# Altium schematic sheet Sheet1.SchDoc
size A4; Organization: Altium Limited; Address1: L3, 12a Rodborough Rd; Address2: Frenchs Forest; Address3: NSW; Address4: Australia 2086
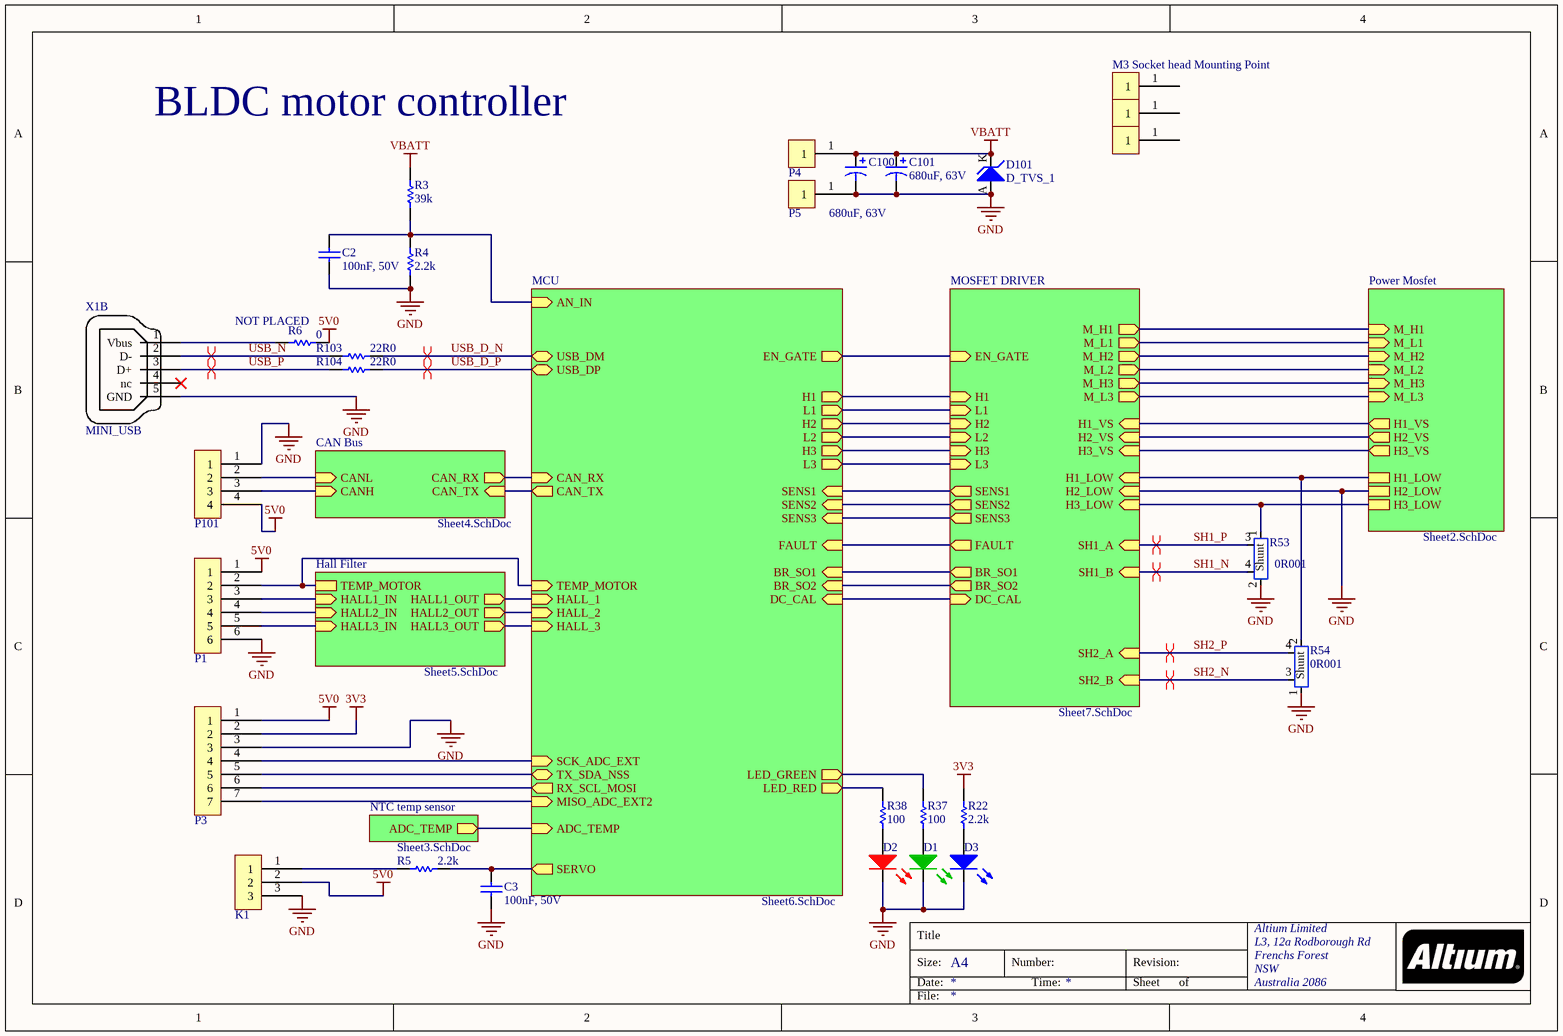
[diagram p0: Sheet1.SchDoc]

## Parts
C2  value 100nF, 50V  [SMD-0603 Capacitor]  (hidden comment: Voltage important)
C3  value 100nF, 50V  [SMD-0603 Capacitor]  (hidden comment: Voltage important)
C100  value 680uF, 63V  [ALU CAP 16DIA 25HIGH]  (hidden comment: CAP_POL)
C101  value 680uF, 63V  [ALU CAP 16DIA 25HIGH]  (hidden comment: CAP_POL)
D1  LED_GREEN  [SMD-0603 LED GREEN]  (value not drawn)
D2  LED_RED  [SMD-0603 LED RED]  (value not drawn)
D3  LED_BLUE  [SMD-0603 LED BLUE]  (value not drawn)
D101  D_TVS_1  [SMC-403-03]
K1  -  [HEADER 3 PIN]  (value not drawn)
M1  M3 Socket head Mounting Point  [M3 Socket head]
M2  M3 Socket head Mounting Point  [M3 Socket head]  (value not drawn)
M3  M3 Socket head Mounting Point  [M3 Socket head]  (value not drawn)
P1  B6B-PH-K-S(LF)(SN)  [JST PH TH VERT 6]  (value not drawn)
P3  B7B-PH-K-S(LF)(SN)  [JST PH TH VERT 7]  (value not drawn)
P4  -  [PAD1]  (value not drawn)
P5  -  [PAD1]  (value not drawn)
P101  B4B-PH-K-S(LF)(SN)  [JST PH TH VERT 4]  (value not drawn)
R3  39k  [SMD-0603 Resistor]
R4  2.2k  [SMD-0603 Resistor]
R5  2.2k  [SMD-0603 Resistor]
R6  0  Place (YES/NO): NOT PLACED  [SMD-0603 Resistor]
R22  2.2k  [SMD-0603 Resistor]
R37  100  [SMD-0603 Resistor]
R38  100  [SMD-0603 Resistor]
R53  0R001  [WSLP2726]
R54  0R001  [WSLP2726]
R103  22R0  [SMD-0603 Resistor]
R104  22R0  [SMD-0603 Resistor]
X1B  MINI_USB  [USB-MICRO B RA SMT-TH]

## Sub-sheets
CAN Bus = Sheet4.SchDoc: CANH (in), CANL (in), CAN_RX (out), CAN_TX (in)
Hall Filter = Sheet5.SchDoc: HALL3_IN (in), HALL2_IN (in), HALL1_IN (in), HALL3_OUT (out), HALL2_OUT (out), HALL1_OUT (out), TEMP_MOTOR
MCU = Sheet6.SchDoc: SENS3 (in), SENS2 (in), SENS1 (in), ADC_TEMP (in), SCK_ADC_EXT (in), MISO_ADC_EXT2 (in), H3 (out), H2 (out), H1 (out), USB_DM (bidir), USB_DP (bidir), BR_SO1 (in), BR_SO2 (in), SERVO (out), HALL_1 (in), HALL_2 (in), CAN_RX (in), CAN_TX (out), DC_CAL (in), L1 (out), L2 (out), L3 (out), TEMP_MOTOR (in), AN_IN (in), LED_GREEN (out), LED_RED (out), TX_SDA_NSS (bidir), RX_SCL_MOSI (out), EN_GATE (out), HALL_3 (in), FAULT (in)
MOSFET DRIVER = Sheet7.SchDoc: FAULT (out), DC_CAL (in), EN_GATE (in), H1 (in), L1 (in), H2 (in), L2 (in), H3 (in), L3 (in), BR_SO1 (out), BR_SO2 (out), M_H1 (out), M_L1 (out), H1_LOW (in), M_H2 (out), H2_VS (in), M_L2 (out), H2_LOW (in), M_H3 (out), H3_VS (in), M_L3 (out), H3_LOW (in), SH1_A (in), SH1_B (in), SH2_A (in), SH2_B (in), SENS1 (out), SENS2 (out), H1_VS (in), SENS3 (out)
NTC temp sensor = Sheet3.SchDoc: ADC_TEMP (out)
Power Mosfet = Sheet2.SchDoc: H1_VS (out), M_H1 (in), M_L1 (in), H1_LOW, H2_VS (out), M_H2 (in), M_L2 (in), H2_LOW, H3_VS (out), M_H3 (in), M_L3 (in), H3_LOW

## Nets
3V3: P3.2 R22.2
5V0: K1.2 P1.1 P3.1 P101.4 R6.2
GND: C2.2 C3.1 C100.2 C101.2 D1.2 D2.2 D3.2 D101.A K1.3 P1.6 P3.3 P5.1 P101.1 R4.1 R53.2 R54.1 X1B.5(GND) ; sheet MOSFET DRIVER/H2_LOW, sheet Power Mosfet/H2_LOW
VBATT: C100.1 C101.1 D101.K P4.1 R3.2
SH1_N: R53.4 ; sheet MOSFET DRIVER/SH1_B
SH1_P: R53.3 ; sheet MOSFET DRIVER/SH1_A
SH2_N: R54.3 ; sheet MOSFET DRIVER/SH2_B
SH2_P: R54.4 ; sheet MOSFET DRIVER/SH2_A
USB_D_N: R103.2 ; sheet MCU/USB_DM
USB_D_P: R104.2 ; sheet MCU/USB_DP
USB_N: R103.1 X1B.2(D-)
USB_P: R104.1 X1B.3(D+)
NetC2_1: C2.1 R3.1 R4.2 ; sheet MCU/AN_IN
NetC3_2: C3.2 R5.2 ; sheet MCU/SERVO
NetD1_1: D1.1 R37.1
NetD2_1: D2.1 R38.1
NetD3_1: D3.1 R22.1
NetK1_1: K1.1 R5.1
NetP1_2: P1.2 ; sheet MCU/TEMP_MOTOR, sheet Hall Filter/TEMP_MOTOR
NetP1_3: P1.3 ; sheet Hall Filter/HALL1_IN
NetP1_4: P1.4 ; sheet Hall Filter/HALL2_IN
NetP1_5: P1.5 ; sheet Hall Filter/HALL3_IN
NetP3_4: P3.4 ; sheet MCU/SCK_ADC_EXT
NetP3_5: P3.5 ; sheet MCU/TX_SDA_NSS
NetP3_6: P3.6 ; sheet MCU/RX_SCL_MOSI
NetP3_7: P3.7 ; sheet MCU/MISO_ADC_EXT2
NetP101_2: P101.2 ; sheet CAN Bus/CANL
NetP101_3: P101.3 ; sheet CAN Bus/CANH
NetR6_1: R6.1 X1B.1(Vbus)
NetR37_2: R37.2 ; sheet MCU/LED_GREEN
NetR38_2: R38.2 ; sheet MCU/LED_RED
NetR53_1: R53.1 ; sheet MOSFET DRIVER/H3_LOW, sheet Power Mosfet/H3_LOW
NetR54_2: R54.2 ; sheet MOSFET DRIVER/H1_LOW, sheet Power Mosfet/H1_LOW
(unnamed): sheet MOSFET DRIVER/FAULT, sheet MCU/FAULT
(unnamed): sheet MOSFET DRIVER/DC_CAL, sheet MCU/DC_CAL
(unnamed): sheet MOSFET DRIVER/EN_GATE, sheet MCU/EN_GATE
(unnamed): sheet MOSFET DRIVER/H1, sheet MCU/H1
(unnamed): sheet MOSFET DRIVER/L1, sheet MCU/L1
(unnamed): sheet MOSFET DRIVER/H2, sheet MCU/H2
(unnamed): sheet MOSFET DRIVER/L2, sheet MCU/L2
(unnamed): sheet MOSFET DRIVER/H3, sheet MCU/H3
(unnamed): sheet MOSFET DRIVER/L3, sheet MCU/L3
(unnamed): sheet MOSFET DRIVER/BR_SO1, sheet MCU/BR_SO1
(unnamed): sheet MOSFET DRIVER/BR_SO2, sheet MCU/BR_SO2
(unnamed): sheet MOSFET DRIVER/M_H1, sheet Power Mosfet/M_H1
(unnamed): sheet MOSFET DRIVER/M_L1, sheet Power Mosfet/M_L1
(unnamed): sheet MOSFET DRIVER/M_H2, sheet Power Mosfet/M_H2
(unnamed): sheet MOSFET DRIVER/H2_VS, sheet Power Mosfet/H2_VS
(unnamed): sheet MOSFET DRIVER/M_L2, sheet Power Mosfet/M_L2
(unnamed): sheet MOSFET DRIVER/M_H3, sheet Power Mosfet/M_H3
(unnamed): sheet MOSFET DRIVER/H3_VS, sheet Power Mosfet/H3_VS
(unnamed): sheet MOSFET DRIVER/M_L3, sheet Power Mosfet/M_L3
(unnamed): sheet MOSFET DRIVER/SENS1, sheet MCU/SENS1
(unnamed): sheet MOSFET DRIVER/SENS2, sheet MCU/SENS2
(unnamed): sheet MOSFET DRIVER/H1_VS, sheet Power Mosfet/H1_VS
(unnamed): sheet MOSFET DRIVER/SENS3, sheet MCU/SENS3
(unnamed): sheet MCU/ADC_TEMP, sheet NTC temp sensor/ADC_TEMP
(unnamed): sheet MCU/HALL_1, sheet Hall Filter/HALL1_OUT
(unnamed): sheet MCU/HALL_2, sheet Hall Filter/HALL2_OUT
(unnamed): sheet MCU/CAN_RX, sheet CAN Bus/CAN_RX
(unnamed): sheet MCU/CAN_TX, sheet CAN Bus/CAN_TX
(unnamed): sheet MCU/HALL_3, sheet Hall Filter/HALL3_OUT

Not connected (* = marked no-connect by the designer): M1 1; M2 1; M3 1; X1B 4(nc)*

## Layout directives
differential pair: SH1_N, SH1_P, SH2_N, SH2_P, USB_D_N, USB_D_P, USB_N, USB_P

## Notes on the sheet
- BLDC motor controller
- Title
- Size:
- Date:
- A4
- Number:
- Time:
- Revision:
- Sheet
- of
- File:
- (in symbol 13) Shunt
- (in symbol 14) Shunt

## Library data of the parts
C2 C3 = 7: CAP 100n, 50V, 0603; Manufacturer Part Number: 06035C104JAT2A; Manufacturer: AVX Corporation; ID: 7; Place (YES/NO): YES
C100 C101 = 21: 680µF 63V Aluminum Capacitors Radial; Manufacturer Part Number: UPW1J681MHD; Manufacturer: Nichicon; ID: 21; Place (YES/NO): YES
D1 = 1: LED Green, 0603; Part Number: LTST-C191KGKT; Manufacturer: Lite-On Inc.; ID: 1; Place (YES/NO): YES; Manufacturer Part Number: LTST-C191KGKT
D2 = 2: LED Red, 0603; Part Number: LTST-C191KRKT; Manufacturer: Lite-On Inc.; ID: 2; Place (YES/NO): YES; Manufacturer Part Number: LTST-C191KRKT
D3 = 3: LED Blue, 0603; Part Number: LBQ39GN1P1351; Manufacturer: OSRAM; ID: 3; Place (YES/NO): YES; Manufacturer Part Number: LBQ39GN1P1351
D101 = 16: TVS DIODE 51VWM 82.4VC SMC; Manufacturer Part Number: SMCJ51A; Manufacturer: ON Semiconductor; ID: 16; Value: 51V; Place (YES/NO): YES
K1 = 6: Breakaway 3 pin Through hole; ID: 6; Place (YES/NO): YES; Manufacturer Part Number: -; Manufacturer: -
M1-M3 = 1: ID: 1; Place (YES/NO): yes; Value: M3
P1 = 3: JST PH Through hole Vertical 6 Pin; ID: 3; Value: JST PH 6 PIN; Place (YES/NO): YES; Manufacturer Part Number: B6B-PH-K-S(LF)(SN); Manufacturer: JST
P3 = 4: JST PH Through hole Vertical 7 Pin; ID: 4; Value: JST PH 4 PIN; Place (YES/NO): YES; Manufacturer Part Number: B7B-PH-K-S(LF)(SN); Manufacturer: JST
P4 P5 = 1: SMD Power landing; ID: 1; Value: -; Place (YES/NO): -; Manufacturer Part Number: -; Manufacturer: -
P101 = 2: JST PH Through hole Vertical 4 Pin; ID: 2; Value: JST PH 4 PIN; Place (YES/NO): YES; Manufacturer Part Number: B4B-PH-K-S(LF)(SN); Manufacturer: JST
R3 = 8: R 39k, 0603; Manufacturer Part Number: ERJ-3EKF3902V; Manufacturer: Panasonic Electronic Components; ID: 8; Place (YES/NO): YES; Value: 39k
R4 R5 R22 = 3: R 2.2k, 0603; Manufacturer Part Number: RK73H1JTTD2201F; Manufacturer: KOA Speer; ID: 3; Place (YES/NO): YES; Value: 2.2k
R6 = 16: R 0 ohm, 0603; Manufacturer: KOA Speer; ID: 16; Value: 0
R37 R38 = 2: R 100ohm, 0603; Manufacturer Part Number: RK73H1JTTD1000F; Manufacturer: KOA Speer; ID: 2; Place (YES/NO): YES; Value: 100
R53 = 13: Shunt 1mOhm; Manufacturer Part Number: WSLP27261L000FEA; Manufacturer: Vishay Dale; ID: 13; Place (YES/NO): YES; Value: 0R001
R54 = 14: Shunt 1mOhm MIRROR; Manufacturer Part Number: WSLP27261L000FEA; Manufacturer: Vishay Dale; ID: 14; Place (YES/NO): YES; Value: 0R001
R103 R104 = 12: R 22R, 0603; Manufacturer Part Number: RK73H1JTTD22R0F; Manufacturer: KOA Speer; ID: 12; Place (YES/NO): YES; Value: 22R0
X1B = 39: CONN USB MICRO B RECPT SMT R/A TH; Manufacturer Part Number: 10118194-0001LF; Manufacturer: Amphenol FCI; ID: 39; Value: Micro-USB; Place (YES/NO): YES